# Altium project Control Board.PrjPcb
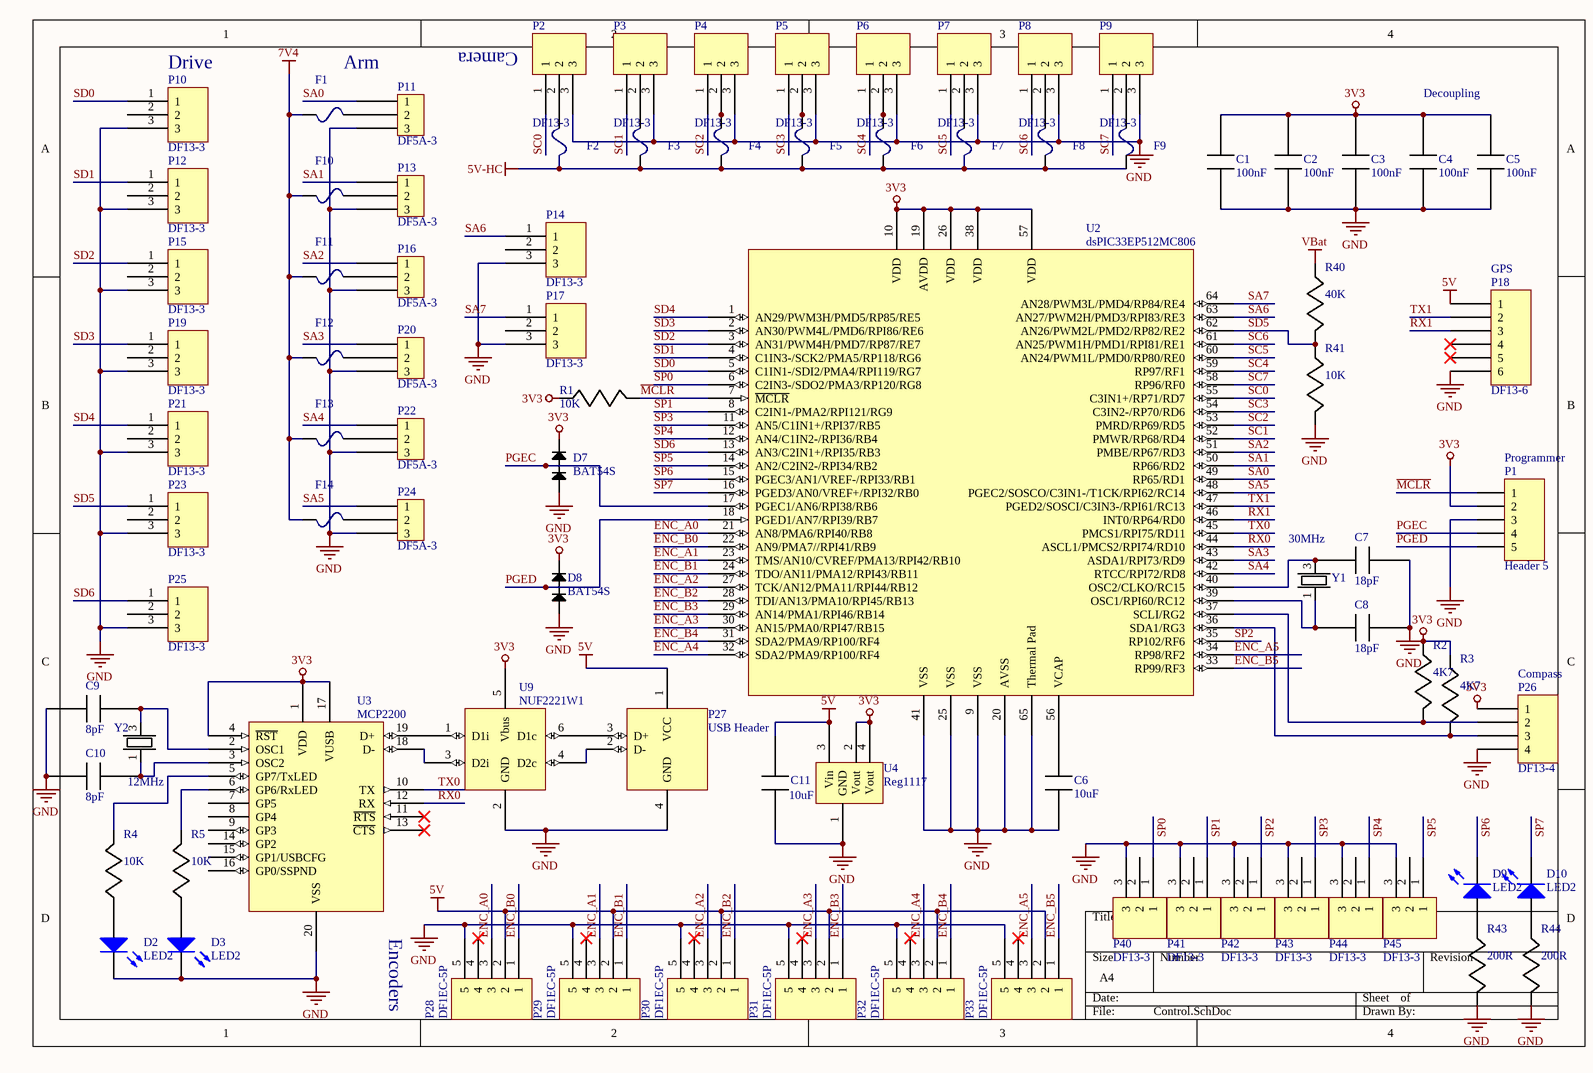
[diagram p0: Control.SchDoc]
7 sheets, 197 parts. Net scope: global (net labels, ports and power ports of the same name join across sheets).
Board file: ControlBoard.PcbDoc
Sheets:
  Control.SchDoc
  Power24V.SchDoc
  Power12V.SchDoc
  Power19V.SchDoc
  Power5V.SchDoc
  Power7V4.SchDoc
  Power.SchDoc

## Sheet Control.SchDoc
size A4

### Parts
C1  100nF  [1608[0603]]
C2  100nF  [1608[0603]]
C3  100nF  [1608[0603]]
C4  100nF  [1608[0603]]
C5  100nF  [1608[0603]]
C6  10uF  [1608[0603]]
C7  18pF  [1608[0603]]
C8  18pF  [1608[0603]]
C9  8pF  [1608[0603]]
C10  8pF  [1608[0603]]
C11  Size: 10uF  [1608[0603]]
D2  LED2  [3.2X1.6X1.1]
D3  LED2  [3.2X1.6X1.1]
D7  BAT54S  [SOT90P240X110-3N]
D8  BAT54S  [SOT90P240X110-3N]
D9  LED2  [1608[0603]]
D10  LED2  [1608[0603]]
F1  RSTA 2-BULK  [56400001009]  (value not drawn)
F2  RSTA 2-BULK  [56400001009]  (value not drawn)
F3  RSTA 2-BULK  [56400001009]  (value not drawn)
F4  RSTA 2-BULK  [56400001009]  (value not drawn)
F5  RSTA 2-BULK  [56400001009]  (value not drawn)
F6  RSTA 2-BULK  [56400001009]  (value not drawn)
F7  RSTA 2-BULK  [56400001009]  (value not drawn)
F8  RSTA 2-BULK  [56400001009]  (value not drawn)
F9  RSTA 2-BULK  [56400001009]  (value not drawn)
F10  RSTA 2-BULK  [56400001009]  (value not drawn)
F11  RSTA 2-BULK  [56400001009]  (value not drawn)
F12  RSTA 2-BULK  [56400001009]  (value not drawn)
F13  RSTA 2-BULK  [56400001009]  (value not drawn)
F14  RSTA 2-BULK  [56400001009]  (value not drawn)
P1  Header 5  [HDR1X5]
P2  DF13-3  [DF13-3]
P3  DF13-3  [DF13-3]
P4  DF13-3  [DF13-3]
P5  DF13-3  [DF13-3]
P6  DF13-3  [DF13-3]
P7  DF13-3  [DF13-3]
P8  DF13-3  [DF13-3]
P9  DF13-3  [DF13-3]
P10  DF13-3  [DF13-3]
P11  DF5A-3  [DF5A-3]
P12  DF13-3  [DF13-3]
P13  DF5A-3  [DF5A-3]
P14  DF13-3  [DF13-3]
P15  DF13-3  [DF13-3]
P16  DF5A-3  [DF5A-3]
P17  DF13-3  [DF13-3]
P18  DF13-6  [DF13-6S-1.25H]
P19  DF13-3  [DF13-3]
P20  DF5A-3  [DF5A-3]
P21  DF13-3  [DF13-3]
P22  DF5A-3  [DF5A-3]
P23  DF13-3  [DF13-3]
P24  DF5A-3  [DF5A-3]
P25  DF13-3  [DF13-3]
P26  DF13-4  [DF13-4S-1.25H]
P27  USB Header  [USB-B]
P28  DF1EC-5P  [DF1EC-4P]
P29  DF1EC-5P  [DF1EC-4P]
P30  DF1EC-5P  [DF1EC-4P]
P31  DF1EC-5P  [DF1EC-4P]
P32  DF1EC-5P  [DF1EC-4P]
P33  DF1EC-5P  [DF1EC-4P]
P40  DF13-3  [DF13-3]
P41  DF13-3  [DF13-3]
P42  DF13-3  [DF13-3]
P43  DF13-3  [DF13-3]
P44  DF13-3  [DF13-3]
P45  DF13-3  [DF13-3]
R1  Size: 10K  [1608[0603]]
R2  Size: 4K7  [1608[0603]]
R3  Size: 4K7  [1608[0603]]
R4  Size: 10K  [1608[0603]]
R5  Size: 10K  [1608[0603]]
R40  Size: 40K  [1608[0603]]
R41  Size: 10K  [1608[0603]]
R43  Size: 200R  [1608[0603]]
R44  Size: 200R  [1608[0603]]
U2  dsPIC33EP512MC806  [QFN50P900X900X100_HS-65N]
U3  MCP2200  [SOP65P780X200-20N]
U4  Reg1117  [SOT230P700X180-4N]
U9  NUF2221W1  [TSOP65P210X110-6N]
Y1  value 30MHz  [7M-30.000MBBK-T]  (hidden comment: NX5032GC)
Y2  value 12MHz  [NX5032GC]  (hidden comment: NX5032GC)

### Nets
3V3: C1.2 C2.2 C3.2 C4.2 C5.2 D7.2(D1i) D8.2(D1i) P1.2 P26.1 R1.2 R2.2 R3.2 U2.10(VDD) U2.19(AVDD) U2.26(VDD) U2.38(VDD) U2.57(VDD) U3.1(VDD) U3.4(~{RST}) U3.17(VUSB) U4.2(Vout) U4.4(Vout) U9.5(Vbus)
5V: C11.2 P18.1 P27.1(VCC) P28.2 P29.2 P30.2 P31.2 P32.2 P33.2 U4.3(Vin)
5V-HC: F2.2 F3.1 F4.1 F5.1 F6.1 F7.1 F8.1 F9.1
7V4: F1.1 F10.1 F11.1 F12.1 F13.1 F14.1
GND: C1.1 C2.1 C3.1 C4.1 C5.1 C6.1 C7.1 C8.1 C9.2 C10.2 C11.1 D2.2(K) D3.2(K) D7.1(D1i) D8.1(D1i) P1.3 P2.3 P3.3 P4.3 P5.3 P6.3 P7.3 P8.3 P9.3 P10.3 P11.3 P12.3 P13.3 P14.3 P15.3 P16.3 P17.3 P18.6 P19.3 P20.3 P21.3 P22.3 P23.3 P24.3 P25.3 P26.4 P27.4(GND) P28.5 P29.5 P30.5 P31.5 P32.5 P33.5 P40.3 P41.3 P42.3 P43.3 P44.3 P45.3 R41.1 R43.1 R44.1 U2.9(VSS) U2.20(AVSS) U2.25(VSS) U2.41(VSS) U2.65(Thermal_Pad) U3.20(VSS) U4.1(GND) U9.2(GND)
VBat: R40.2
ENC_A0: P28.3 U2.21(AN8/PMA6/RPI40/RB8)
ENC_A1: P29.3 U2.23(TMS/AN10/CVREF/PMA13/RPI42/RB10)
ENC_A2: P30.3 U2.27(TCK/AN12/PMA11/RPI44/RB12)
ENC_A3: P31.3 U2.30(AN15/PMA0/RPI47/RB15)
ENC_A4: P32.3 U2.32(SDA2/PMA9/RP100/RF4)
ENC_A5: P33.3 U2.34(RP98/RF2)
ENC_B0: P28.1 U2.22(AN9/PMA7//RPI41/RB9)
ENC_B1: P29.1 U2.24(TDO/AN11/PMA12/RPI43/RB11)
ENC_B2: P30.1 U2.28(TDI/AN13/PMA10/RPI45/RB13)
ENC_B3: P31.1 U2.29(AN14/PMA1/RPI46/RB14)
ENC_B4: P32.1 U2.31(SDA2/PMA9/RP100/RF4)
ENC_B5: P33.1 U2.33(RP99/RF3)
~{MCLR}: P1.1 R1.1 U2.7(~{MCLR})
PGEC: D7.3(D1i) P1.4 U2.17(PGEC1/AN6/RPI38/RB6)
PGED: D8.3(D1i) P1.5 U2.18(PGED1/AN7/RPI39/RB7)
RX0: U2.44(ASCL1/PMCS2/RPI74/RD10) U3.12(RX)
RX1: P18.3 U2.46(INT0/RP64/RD0)
SA0: P11.1 U2.49(RP65/RD1)
SA1: P13.1 U2.50(RP66/RD2)
SA2: P16.1 U2.51(PMBE/RP67/RD3)
SA3: P20.1 U2.43(ASDA1/RPI73/RD9)
SA4: P22.1 U2.42(RTCC/RPI72/RD8)
SA5: P24.1 U2.48(PGEC2/SOSCO/C3IN1-/T1CK/RPI62/RC14)
SA6: P14.1 U2.63(AN27/PWM2H/PMD3/RPI83/RE3)
SA7: P17.1 U2.64(AN28/PWM3L/PMD4/RP84/RE4)
SC0: P2.1 U2.55(C3IN1+/RP71/RD7)
SC1: P3.1 U2.52(PMWR/RP68/RD4)
SC2: P4.1 U2.53(PMRD/RP69/RD5)
SC3: P5.1 U2.54(C3IN2-/RP70/RD6)
SC4: P6.1 U2.59(RP97/RF1)
SC5: P7.1 U2.60(AN24/PWM1L/PMD0/RP80/RE0)
SC6: P8.1 U2.61(AN25/PWM1H/PMD1/RPI81/RE1)
SC7: P9.1 U2.58(RP96/RF0)
SD0: P10.1 U2.5(C1IN1-/SDI2/PMA4/RPI119/RG7)
SD1: P12.1 U2.4(C1IN3-/SCK2/PMA5/RP118/RG6)
SD2: P15.1 U2.3(AN31/PWM4H/PMD7/RP87/RE7)
SD3: P19.1 U2.2(AN30/PWM4L/PMD6/RPI86/RE6)
SD4: P21.1 U2.1(AN29/PWM3H/PMD5/RP85/RE5)
SD5: P23.1 R40.1 R41.2 U2.62(AN26/PWM2L/PMD2/RP82/RE2)
SD6: P25.1 U2.13(AN3/C2IN1+/RPI35/RB3)
SP0: P40.1 U2.6(C2IN3-/SDO2/PMA3/RP120/RG8)
SP1: P41.1 U2.8(C2IN1-/PMA2/RPI121/RG9)
SP2: P42.1 U2.35(RP102/RF6)
SP3: P43.1 U2.11(AN5/C1IN1+/RPI37/RB5)
SP4: P44.1 U2.12(AN4/C1IN2-/RPI36/RB4)
SP5: P45.1 U2.14(AN2/C2IN2-/RPI34/RB2)
SP6: D9.2(K) U2.15(PGEC3/AN1/VREF-/RPI33/RB1)
SP7: D10.2(K) U2.16(PGED3/AN0/VREF+/RPI32/RB0)
TX0: U2.45(PMCS1/RPI75/RD11) U3.10(TX)
TX1: P18.2 U2.47(PGED2/SOSCI/C3IN3-/RPI61/RC13)
NetC6_2: C6.2 U2.56(VCAP)
NetC7_2: C7.2 U2.40(OSC2/CLKO/RC15) Y1.3
NetC8_2: C8.2 U2.39(OSC1/RPI60/RC12) Y1.1
NetC9_1: C9.1 U3.2(OSC1) Y2.3
NetC10_1: C10.1 U3.3(OSC2) Y2.1
NetD2_1: D2.1(A) R4.2
NetD3_1: D3.1(A) R5.2
NetD9_1: D9.1(A) R43.2
NetD10_1: D10.1(A) R44.2
NetF1_2: F1.2 P11.2
NetF2_1: F2.1 P2.2
NetF3_2: F3.2 P3.2
NetF4_2: F4.2 P4.2
NetF5_2: F5.2 P5.2
NetF6_2: F6.2 P6.2
NetF7_2: F7.2 P7.2
NetF8_2: F8.2 P8.2
NetF9_2: F9.2 P9.2
NetF10_2: F10.2 P13.2
NetF11_2: F11.2 P16.2
NetF12_2: F12.2 P20.2
NetF13_2: F13.2 P22.2
NetF14_2: F14.2 P24.2
NetP26_2: P26.2 R2.1 U2.37(SCLI/RG2)
NetP26_3: P26.3 R3.1 U2.36(SDA1/RG3)
NetP27_2: P27.2(D-) U9.4(D2c)
NetP27_3: P27.3(D+) U9.6(D1c)
NetR4_1: R4.1 U3.5(GP7/TxLED)
NetR5_1: R5.1 U3.6(GP6/RxLED)
NetU3_18: U3.18(D-) U9.3(D2i)
NetU3_19: U3.19(D+) U9.1(D1i)

Not connected (* = marked no-connect by the designer): P10 2; P12 2; P14 2; P15 2; P17 2; P18 4* 5*; P19 2; P21 2; P23 2; P25 2; P28 4*; P29 4*; P30 4*; P31 4*; P32 4*; P33 4*; P40 2; P41 2; P42 2; P43 2; P44 2; P45 2; U3 7(GP5) 8(GP4) 9(GP3) 11(~{RTS})* 13(~{CTS})* 14(GP2) 15(GP1/USBCFG) 16(GP0/SSPND)

### Notes on the sheet
- (near P2) Camera
- (near P10) Drive
- Arm
- Decoupling
- (near P18) GPS
- (near P1) Programmer
- (near P26) Compass
- (near U3) Encoders

### Library data of the parts
C1-C11 = Capacitor
D2 D3 D9 D10 = LED2: Typical RED, GREEN, YELLOW, AMBER GaAs LED; Published: 8-Jun-2000; LatestRevisionDate: 17-Jul-2002; LatestRevisionNote: Re-released for DXP Platform.; PackageVersion: Feb-2002; PackageReference: 3.2X1.6X1.1; Publisher: Altium Limited; PackageDescription: SM LED; 2 Flat Leads
F1-F14 = RSTA 2-BULK: FUSE 2A 250/277V RADIAL
P1 = Header 5: Header, 5-Pin; LatestRevisionDate: 17-Jul-2002; LatestRevisionNote: Re-released for DXP Platform.; Publisher: Altium Limited
R1-R5 R40 R41 R43 R44 = Resistor

## Sheet Power24V.SchDoc
size 283 x 191 mm; SheetNumber: 1; SheetTotal: 1
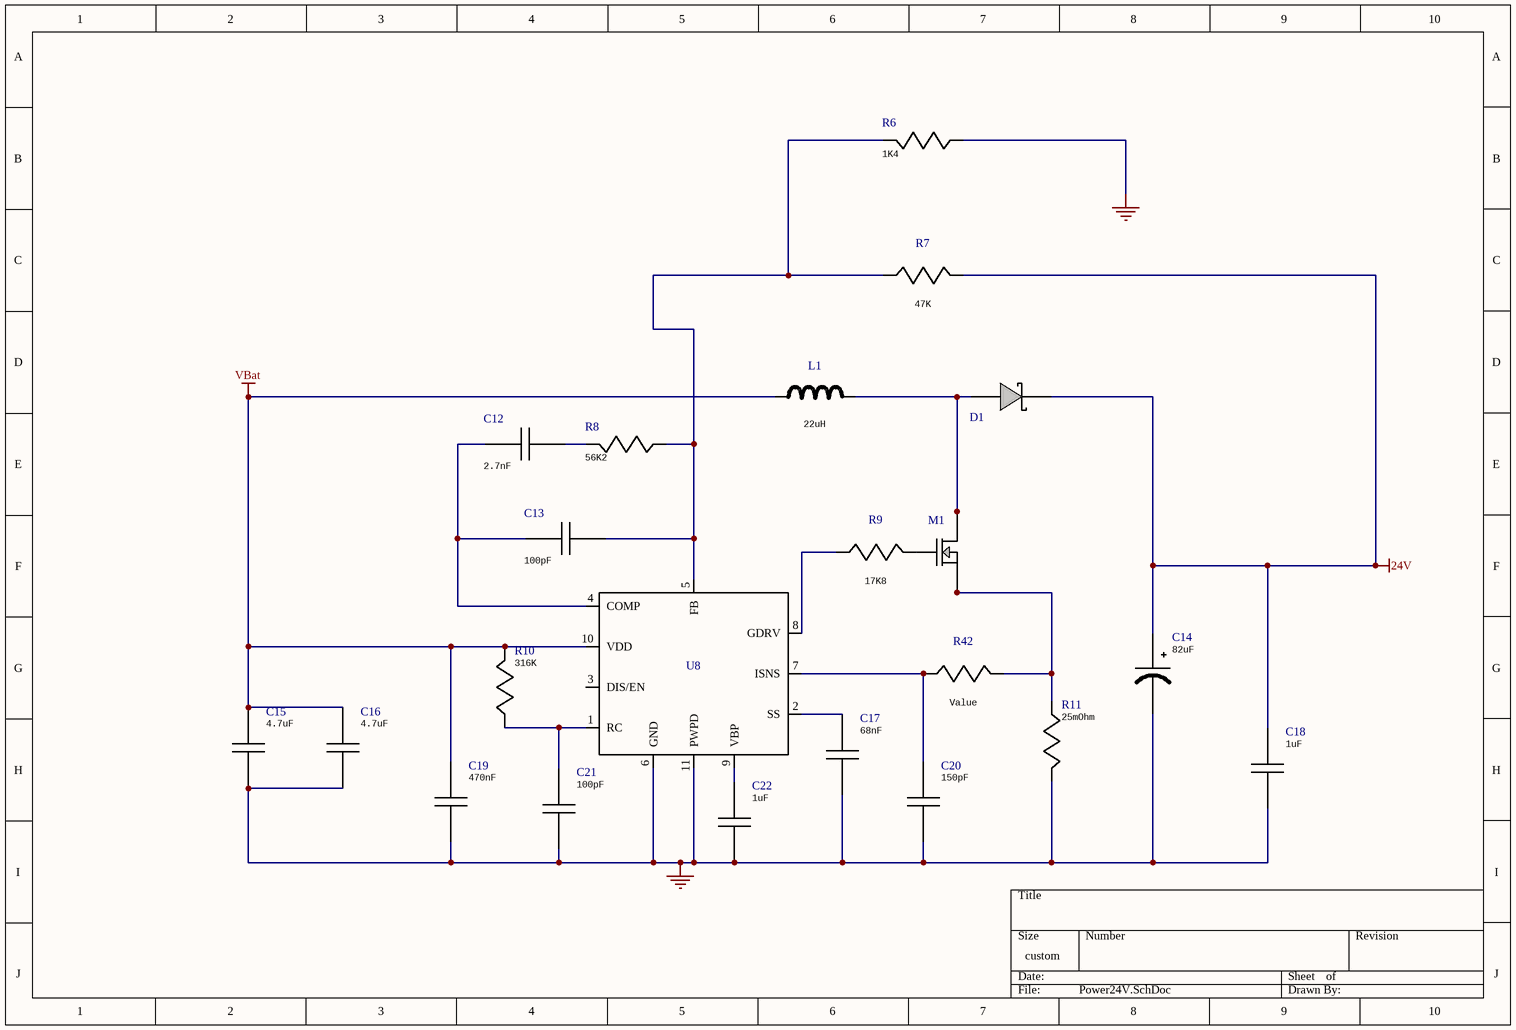
[diagram p1: Power24V.SchDoc]

### Parts
C12  value 2.7nF  [1608]  (hidden comment: CC0805KRX7R9BB27)
C13  value 100pF  [1608]  (hidden comment: CC0805JRNPO9BN10)
C14  value 82uF  [CAPSMT_62_E12]  (hidden comment: 35SVPF82M)
C15  value 4.7uF  [0805]  (hidden comment: GRM21BR61E475MA1)
C16  value 4.7uF  [0805]  (hidden comment: GRM21BR61E475MA1)
C17  value 68nF  [1608]  (hidden comment: GRM155R61A683KA0)
C18  value 1uF  [0805]  (hidden comment: GMK212B7105KG-T)
C19  value 470nF  [0805]  (hidden comment: EMK212B7474KD-T)
C20  value 150pF  [0805]  (hidden comment: CC0805JRNPO9BN15)
C21  value 100pF  [1608]  (hidden comment: CC0805JRNPO9BN10)
C22  value 1uF  [1608]  (hidden comment: C1608X5R1C105K)
D1  B240A-13-F  [SMA]  (value not drawn)
L1  value 22uH  [SRR1210]  (hidden comment: SRR1210-220M)
M1  CSD17551Q5A  [TRANS_NexFET_Q5A]  (value not drawn)
R6  value 1K4  [1608]  (hidden comment: CRCW04021K40FKED)
R7  value 47K  [1608]  (hidden comment: RR1220P-473-D)
R8  value 56K2  [1608]  (hidden comment: CRCW040256K2FKED)
R9  value 17K8  [1608]  (hidden comment: CRCW040217R8FKED)
R10  value 316K  [1608]  (hidden comment: CRCW0402316KFKED)
R11  value 25mOhm  [1206]  (hidden comment: CSR1206FK25L0)
R42  CRCW04021K00FKED  [1608]  (value not drawn)
U8  TPS40210DGQR  [S-PDSO-G10]  (value not drawn)

### Nets
24V: C14.1(+) C18.1 D1.1(K) R7.1
GND: C14.2(-) C15.2 C16.2 C17.2 C18.2 C19.2 C20.2 C21.2 C22.2 R6.2 R11.1 U8.6(GND) U8.11(PWPD)
VBat: C15.1 C16.1 C19.1 L1.1 R10.1 U8.10(VDD)
NetC12_1: C12.1 C13.1 U8.4(COMP)
NetC12_2: C12.2 R8.1
NetC13_2: C13.2 R6.1 R7.2 R8.2 U8.5(FB)
NetC17_1: C17.1 U8.2(SS)
NetC20_1: C20.1 R42.2 U8.7(ISNS)
NetC21_1: C21.1 R10.2 U8.1(RC)
NetC22_1: C22.1 U8.9(VBP)
NetD1_2: D1.2(A) L1.2 M1.5(Drain) M1.6(Drain) M1.7(Drain) M1.8(Drain) M1.9(Drain)
NetM1_1: M1.1(Source) M1.2(Source) M1.3(Source) R11.2 R42.1
NetM1_4: M1.4(Gate) R9.1
NetR9_2: R9.2 U8.8(GDRV)

Not connected (* = marked no-connect by the designer): U8 3(DIS/EN)

### Library data of the parts
C12 = CC0805KRX7R9BB27: Imported; Manufacturer_Part_Number: CC0805KRX7R9BB272; Vendor: Yageo America; RefName: Ccomp; Manufacturer_Name: Yageo America; RefDes: RefDes; TYPE: TYPE
C13 = CC0805JRNPO9BN10: Imported; Manufacturer_Part_Number: CC0805JRNPO9BN101; Vendor: Yageo America; RefName: Ccomp2; Manufacturer_Name: Yageo America; RefDes: RefDes; TYPE: TYPE
C14 = 35SVPF82M: Imported; Vendor: Panasonic; RN: Cout; Manufacturer_Part_Number: 35SVPF82M; Manufacturer_Name: Panasonic; RefDes: RefDes; TYPE: TYPE
C15 C16 = GRM21BR61E475MA1: Imported; Manufacturer_Part_Number: GRM21BR61E475MA12L; Vendor: MuRata; RefName: Cin; Manufacturer_Name: MuRata; RefDes: RefDes; TYPE: TYPE
C17 = GRM155R61A683KA0: Imported; Manufacturer_Part_Number: GRM155R61A683KA01D; Vendor: MuRata; RN: Css; Manufacturer_Name: MuRata; RefDes: RefDes; TYPE: TYPE
C18 = GMK212B7105KG-T: Imported; Vendor: Taiyo Yuden; RN: Coutx; Manufacturer_Part_Number: GMK212B7105KG-T; Manufacturer_Name: Taiyo Yuden; RefDes: RefDes; TYPE: TYPE
C19 = EMK212B7474KD-T: Imported; Vendor: Taiyo Yuden; RefName: Cbyp; Manufacturer_Part_Number: EMK212B7474KD-T; Manufacturer_Name: Taiyo Yuden; RefDes: RefDes; TYPE: TYPE
C20 = CC0805JRNPO9BN15: Imported; Manufacturer_Part_Number: CC0805JRNPO9BN151; Vendor: Yageo America; RN: Ciflt; Manufacturer_Name: Yageo America; RefDes: RefDes; TYPE: TYPE
C21 = CC0805JRNPO9BN10: Imported; Manufacturer_Part_Number: CC0805JRNPO9BN101; Vendor: Yageo America; RefName: Crc; Manufacturer_Name: Yageo America; RefDes: RefDes; TYPE: TYPE
C22 = C1608X5R1C105K: Imported; Vendor: TDK; RefName: Cbp; Manufacturer_Part_Number: C1608X5R1C105K; Manufacturer_Name: TDK; RefDes: RefDes; TYPE: TYPE
D1 = B240A-13-F: Imported; Vendor: Diodes Inc.; Value: Value; Manufacturer_Part_Number: B240A-13-F; Manufacturer_Name: Diodes Inc.; RefDes: RefDes; Type: Type
L1 = SRR1210-220M: Imported; Vendor: Bourns; Manufacturer_Part_Number: SRR1210-220M; Manufacturer_Name: Bourns; RefDes: RefDes; TYPE: TYPE
M1 = CSD17551Q5A: Imported; Vendor: Texas Instruments; Value: Value; Manufacturer_Part_Number: CSD17551Q5A; Manufacturer_Name: Texas Instruments; RefDes: RefDes; TYPE: TYPE
R6 = CRCW04021K40FKED: Imported; Vendor: Vishay-Dale; RN: Rfb1; Manufacturer_Part_Number: CRCW04021K40FKED; Manufacturer_Name: Vishay-Dale; RefDes: RefDes; TYPE: TYPE
R7 = RR1220P-473-D: Imported; Vendor: Susumu Co Ltd; RN: Rfb2; Manufacturer_Part_Number: RR1220P-473-D; Manufacturer_Name: Susumu Co Ltd; RefDes: RefDes; TYPE: TYPE
R8 = CRCW040256K2FKED: Imported; Vendor: Vishay-Dale; RefName: Rcomp; Manufacturer_Part_Number: CRCW040256K2FKED; Manufacturer_Name: Vishay-Dale; RefDes: RefDes; TYPE: TYPE
R9 = CRCW040217R8FKED: Imported; Vendor: Vishay-Dale; RN: Rg; Manufacturer_Part_Number: CRCW040217R8FKED; Manufacturer_Name: Vishay-Dale; RefDes: RefDes; TYPE: TYPE
R10 = CRCW0402316KFKED: Imported; Vendor: Vishay-Dale; RefName: Rrc; Manufacturer_Part_Number: CRCW0402316KFKED; Manufacturer_Name: Vishay-Dale; RefDes: RefDes; TYPE: TYPE
R11 = CSR1206FK25L0: Imported; Vendor: Stackpole Electronics Inc; rn: Rsense; Manufacturer_Part_Number: CSR1206FK25L0; Manufacturer_Name: Stackpole Electronics Inc; RefDes: RefDes; TYPE: TYPE
R42 = CRCW04021K00FKED: Riflt; Vendor: Vishay-Dale; Value: Value; Manufacturer_Part_Number: CRCW04021K00FKED; Manufacturer_Name: Vishay-Dale; RefDes: RefDes; TYPE: TYPE
U8 = TPS40210DGQR: Imported; Vendor: Texas Instruments; Value: Value; Manufacturer_Part_Number: TPS40210DGQR; Manufacturer_Name: Texas Instruments; RefDes: RefDes; TYPE: TYPE

## Sheet Power12V.SchDoc
size 359 x 172 mm; SheetNumber: 1; SheetTotal: 1
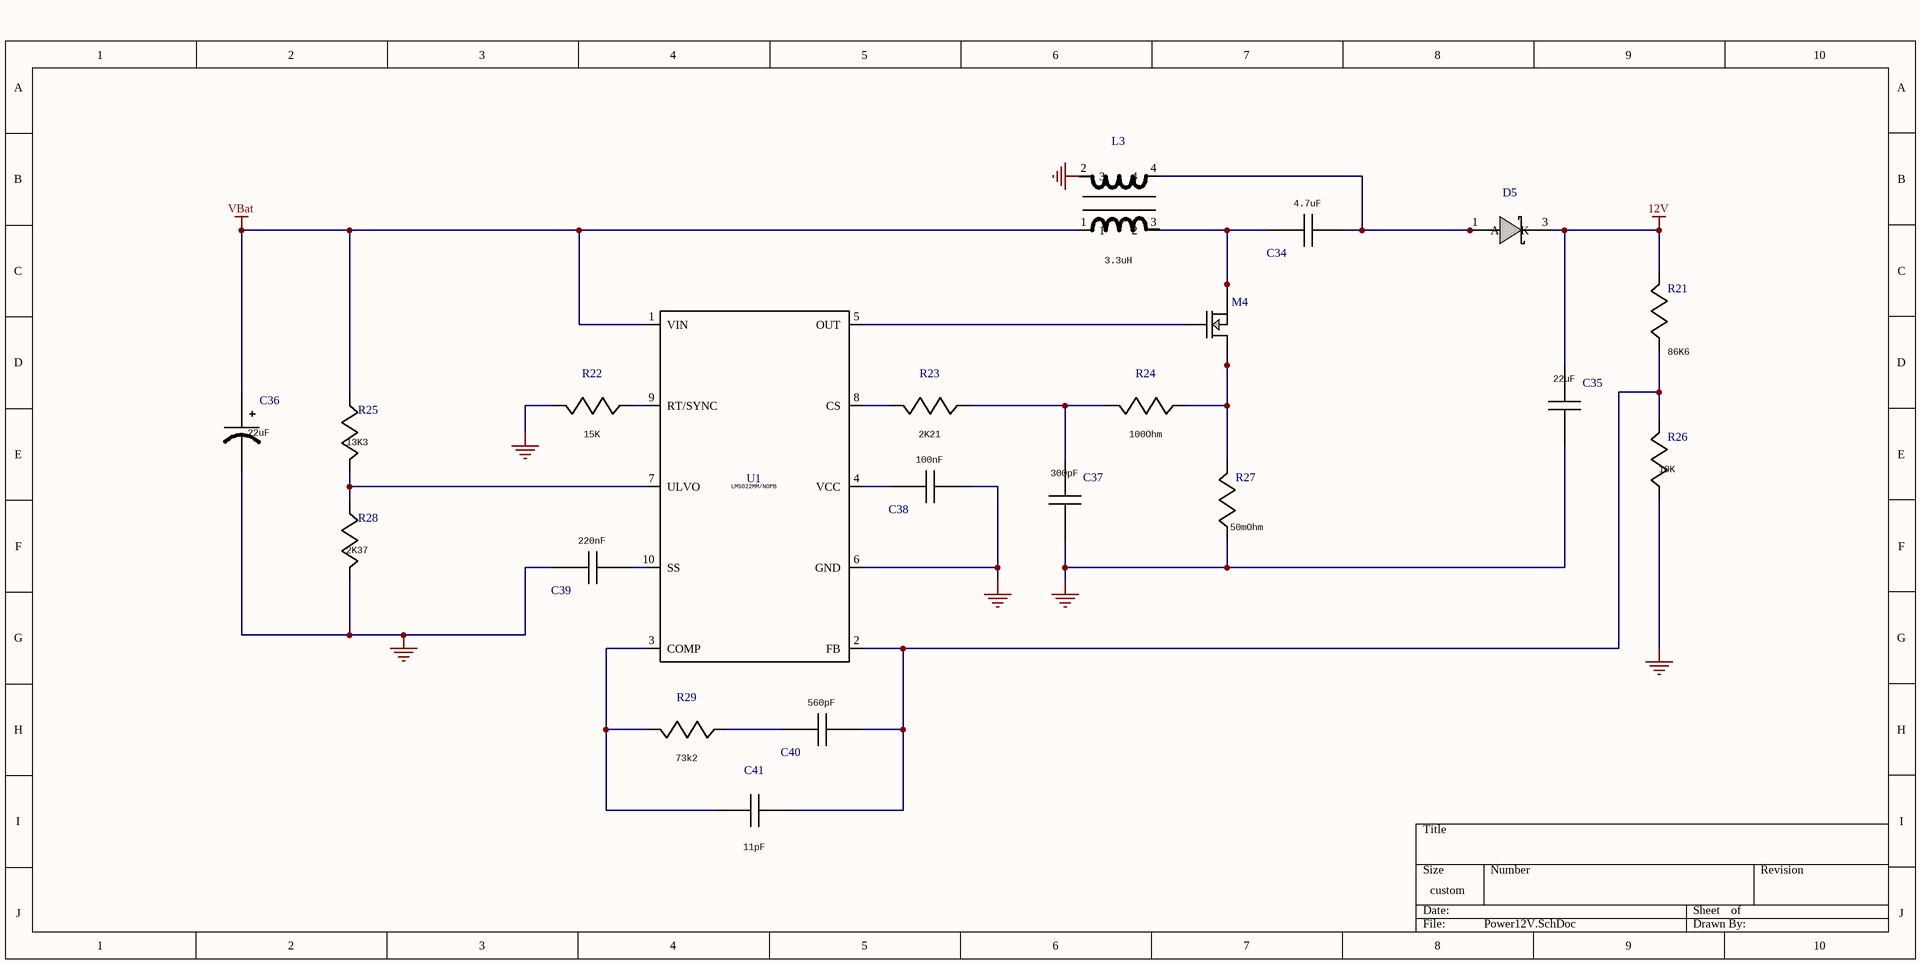
[diagram p2: Power12V.SchDoc]

### Parts
C34  value 4.7uF  [0805]  (hidden comment: GRM21BR61E475MA1)
C35  value 22uF  [1210]  (hidden comment: GRM32ER61C226KE2)
C36  value 22uF  [3528-21]  (hidden comment: TPSB226K020R0400)
C37  value 300pF  [1608]  (hidden comment: GRM1555C1E301JA0)
C38  value 100nF  [1608]  (hidden comment: GRM155R61C104KA8)
C39  value 220nF  [1608]  (hidden comment: GRM155R71C224KA1)
C40  value 560pF  [1608]  (hidden comment: CC0805KRX7R9BB56)
C41  value 11pF  [1608]  (hidden comment: C0603C0G1E110G)
D5  PDS760-13  [PowerDI5]  (value not drawn)
L3  value 3.3uH  [DRQ127]  (hidden comment: DRQ127-3R3-R)
M4  CSD16340Q3  [TRANS_NexFET_Q3]  (value not drawn)
R21  value 86K6  [1608]  (hidden comment: CRCW040286K6FKED)
R22  value 15K  [1608]  (hidden comment: CRCW040215K0FKED)
R23  value 2K21  [1608]  (hidden comment: CRCW04022K21FKED)
R24  value 100Ohm  [1608]  (hidden comment: CRCW0402100RFKED)
R25  value 13K3  [1608]  (hidden comment: CRCW040213K3FKED)
R26  value 10K  [1608]  (hidden comment: CRCW040210K0FKED)
R27  value 50mOhm  [2010]  (hidden comment: CSRN2010FK50L0)
R28  value 2K37  [1608]  (hidden comment: CRCW04022K37FKED)
R29  value 73k2  [1608]  (hidden comment: CRCW040273K2FKED)
U1  LM5022MM/NOPB  [MUB10A]

### Nets
12V: C35.1 D5.3(K) R21.1
GND: C35.2 C36.2(-) C37.2 C38.2 C39.2 L3.2(3) R22.1 R26.2 R27.2 R28.1 U1.6(GND)
VBat: C36.1(+) L3.1 R25.2 U1.1(VIN)
NetC34_1: C34.1 D5.1(A) D5.2(A) L3.4
NetC34_2: C34.2 L3.3(2) M4.1(Source) M4.2(Source) M4.3(Source)
NetC37_1: C37.1 R23.2 R24.1
NetC38_1: C38.1 U1.4(VCC)
NetC39_1: C39.1 U1.10(SS)
NetC40_1: C40.1 C41.1 R21.2 R26.1 U1.2(FB)
NetC40_2: C40.2 R29.2
NetC41_2: C41.2 R29.1 U1.3(COMP)
NetM4_4: M4.4(Gate) U1.5(OUT)
NetM4_5: M4.5(Drain) M4.6(Drain) M4.7(Drain) M4.8(Drain) M4.9(Drain) R24.2 R27.1
NetR22_2: R22.2 U1.9(RT/SYNC)
NetR23_1: R23.1 U1.8(CS)
NetR25_1: R25.1 R28.2 U1.7(ULVO)

### Library data of the parts
C34 = GRM21BR61E475MA1: Imported; Manufacturer_Part_Number: GRM21BR61E475MA12L; Vendor: MuRata; rn: Csep; Manufacturer_Name: MuRata; RefDes: RefDes; TYPE: TYPE
C35 = GRM32ER61C226KE2: Imported; Manufacturer_Part_Number: GRM32ER61C226KE20L; Vendor: MuRata; rn: Cout; Manufacturer_Name: MuRata; RefDes: RefDes; TYPE: TYPE
C36 = TPSB226K020R0400: Imported; Vendor: AVX; rn: Cin; Manufacturer_Part_Number: TPSB226K020R0400; Manufacturer_Name: AVX; RefDes: RefDes; TYPE: TYPE
C37 = GRM1555C1E301JA0: Imported; Manufacturer_Part_Number: GRM1555C1E301JA01D; Vendor: MuRata; rn: Cramp; Manufacturer_Name: MuRata; RefDes: RefDes; TYPE: TYPE
C38 = GRM155R61C104KA8: Imported; Manufacturer_Part_Number: GRM155R61C104KA88D; Vendor: MuRata; rn: Ccc; Manufacturer_Name: MuRata; RefDes: RefDes; TYPE: TYPE
C39 = GRM155R71C224KA1: Imported; Manufacturer_Part_Number: GRM155R71C224KA12D; Vendor: MuRata; rn: Css; Manufacturer_Name: MuRata; RefDes: RefDes; TYPE: TYPE
C40 = CC0805KRX7R9BB56: Imported; Manufacturer_Part_Number: CC0805KRX7R9BB561; Vendor: Yageo America; rn: Ccomp; Manufacturer_Name: Yageo America; RefDes: RefDes; TYPE: TYPE
C41 = C0603C0G1E110G: Imported; Vendor: TDK; rn: Ccomp2; Manufacturer_Part_Number: C0603C0G1E110G; Manufacturer_Name: TDK; RefDes: RefDes; TYPE: TYPE
D5 = PDS760-13: Imported; Vendor: Diodes Inc.; Value: Value; Manufacturer_Part_Number: PDS760-13; Manufacturer_Name: Diodes Inc.; RefDes: RefDes; TYPE: TYPE
L3 = DRQ127-3R3-R: Imported; Type: SMT; Vendor: Coiltronics; Manufacturer_Part_Number: DRQ127-3R3-R; Manufacturer_Name: Coiltronics; RefDes: RefDes
M4 = CSD16340Q3: Imported; Vendor: Texas Instruments; Value: Value; Manufacturer_Part_Number: CSD16340Q3; Manufacturer_Name: Texas Instruments; RefDes: RefDes; TYPE: TYPE
R21 = CRCW040286K6FKED: Imported; Vendor: Vishay-Dale; rn: Rfb2; Manufacturer_Part_Number: CRCW040286K6FKED; Manufacturer_Name: Vishay-Dale; RefDes: RefDes; TYPE: TYPE
R22 = CRCW040215K0FKED: Imported; Vendor: Vishay-Dale; rn: Rfadj; Manufacturer_Part_Number: CRCW040215K0FKED; Manufacturer_Name: Vishay-Dale; RefDes: RefDes; TYPE: TYPE
R23 = CRCW04022K21FKED: Imported; Vendor: Vishay-Dale; rn: Rramp2; Manufacturer_Part_Number: CRCW04022K21FKED; Manufacturer_Name: Vishay-Dale; RefDes: RefDes; TYPE: TYPE
R24 = CRCW0402100RFKED: Imported; Vendor: Vishay-Dale; rn: Rramp; Manufacturer_Part_Number: CRCW0402100RFKED; Manufacturer_Name: Vishay-Dale; RefDes: RefDes; TYPE: TYPE
R25 = CRCW040213K3FKED: Imported; Vendor: Vishay-Dale; rn: Ruvpt; Manufacturer_Part_Number: CRCW040213K3FKED; Manufacturer_Name: Vishay-Dale; RefDes: RefDes; TYPE: TYPE
R26 = CRCW040210K0FKED: Imported; Vendor: Vishay-Dale; rn: Rfb1; Manufacturer_Part_Number: CRCW040210K0FKED; Manufacturer_Name: Vishay-Dale; RefDes: RefDes; TYPE: TYPE
R27 = CSRN2010FK50L0: Imported; Vendor: Stackpole Electronics Inc; rn: Rsense; Manufacturer_Part_Number: CSRN2010FK50L0; Manufacturer_Name: Stackpole Electronics Inc; RefDes: RefDes; TYPE: TYPE
R28 = CRCW04022K37FKED: Imported; Vendor: Vishay-Dale; rn: Ruvpb; Manufacturer_Part_Number: CRCW04022K37FKED; Manufacturer_Name: Vishay-Dale; RefDes: RefDes; TYPE: TYPE
R29 = CRCW040273K2FKED: Imported; Vendor: Vishay-Dale; rn: Rcomp; Manufacturer_Part_Number: CRCW040273K2FKED; Manufacturer_Name: Vishay-Dale; RefDes: RefDes; TYPE: TYPE
U1 = LM5022MM/NOPB: Imported; Vendor: Texas Instruments; Value: Value; Manufacturer_Part_Number: LM5022MM/NOPB; Manufacturer_Name: Texas Instruments; RefDes: RefDes; TYPE: TYPE

## Sheet Power19V.SchDoc
size 375 x 157 mm; SheetNumber: 1; SheetTotal: 1
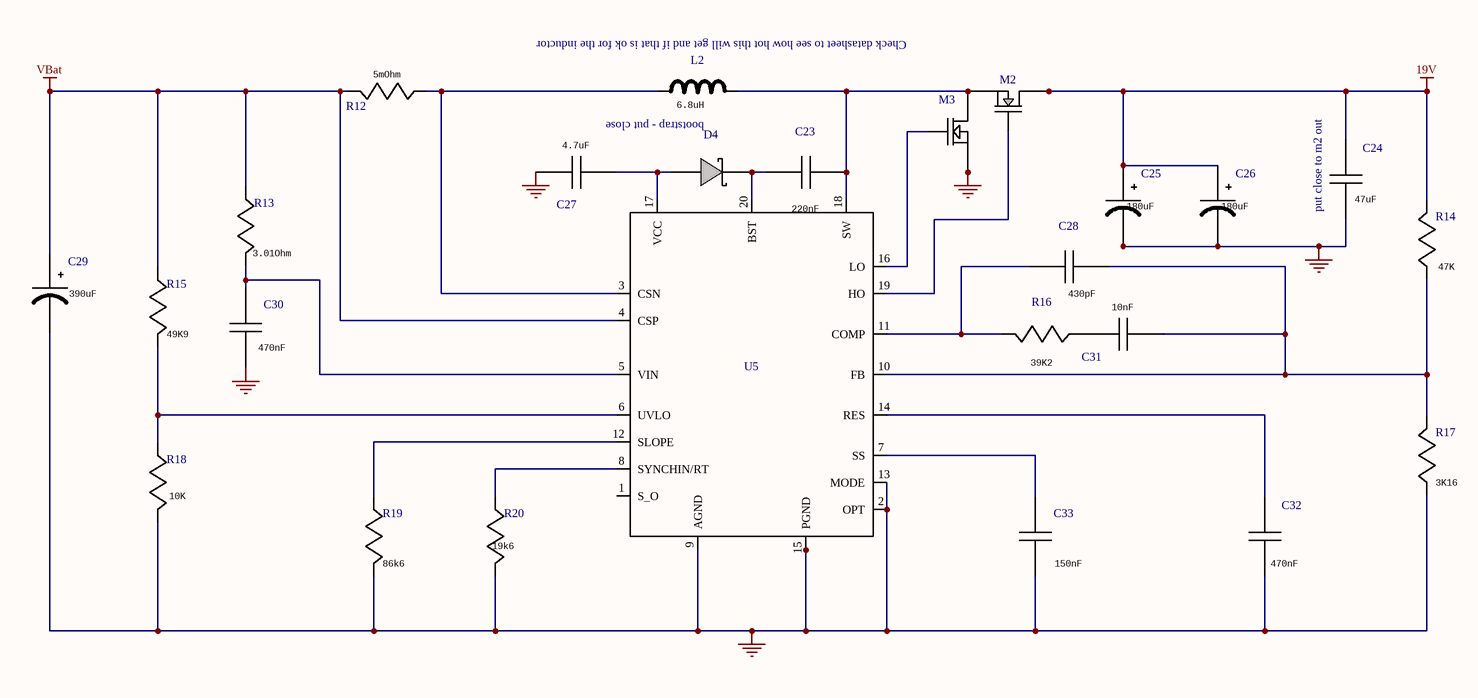
[diagram p3: Power19V.SchDoc]

### Parts
C23  value 220nF  [1608]  (hidden comment: C0805C224K5RACTU)
C24  value 47uF  [1206]  (hidden comment: C3216JB1E476M)
C25  value 180uF  [CAPSMT_62_E12]  (hidden comment: 25SVPF180M)
C26  value 180uF  [CAPSMT_62_E12]  (hidden comment: 25SVPF180M)
C27  value 4.7uF  [1608]  (hidden comment: GRM21BC81E475KA1)
C28  value 430pF  [1608]  (hidden comment: CL21C431JBANNNC)
C29  value 390uF  [CAPSMT_62_E12]  (hidden comment: 20SVPF390M)
C30  value 470nF  [1608]  (hidden comment: GRM188R71C474KA8)
C31  value 10nF  [1608]  (hidden comment: GRM216R71H103KA0)
C32  value 470nF  [1608]  (hidden comment: TMK212BJ474KD-T)
C33  value 150nF  [1608]  (hidden comment: GRM155R61A154KE1)
D4  MBR130T1G  [SOD-123]  (value not drawn)
L2  value 6.8uH  [XAL1010]  (hidden comment: XAL1010-682MEB)
M2  CSD16340Q3  [TRANS_NexFET_Q3]  (value not drawn)
M3  BSZ035N03MS G  [PG-TSDSON-8]  (value not drawn)
R12  value 5mOhm  [1608]  (hidden comment: PRL1632-R005-F-T)
R13  value 3.01Ohm  [1608]  (hidden comment: CRCW08053R01FKEA)
R14  value 47K  [1608]  (hidden comment: RR1220P-473-D)
R15  value 49K9  [1608]  (hidden comment: CRCW040249K9FKED)
R16  value 39K2  [1608]  (hidden comment: CRCW040239K2FKED)
R17  value 3K16  [1608]  (hidden comment: CRCW04023K16FKED)
R18  value 10K  [1608]  (hidden comment: CRCW040210K0FKED)
R19  value 86k6  [1608]  (hidden comment: CRCW040286K6FKED)
R20  value 19k6  [1608]  (hidden comment: CRCW040219K6FKED)
U5  LM5122MH/NOPB  [MXA20A]  (value not drawn)

### Nets
19V: C24.1 C25.1(+) C26.1(+) M2.5(Drain) M2.6(Drain) M2.7(Drain) M2.8(Drain) M2.9(Drain) R14.1
GND: C24.2 C25.2(-) C26.2(-) C27.1 C29.2(-) C30.2 C32.2 C33.2 M3.1(Source) M3.2(Source) M3.3(Source) R17.2 R18.1 R19.1 R20.1 U5.2(OPT) U5.9(AGND) U5.13(MODE) U5.15(PGND) U5.21(PGND)
VBat: C29.1(+) R12.1 R13.2 R15.2 U5.4(CSP)
NetC23_1: C23.1 D4.1(K) U5.20(BST)
NetC23_2: C23.2 L2.2 M2.1(Source) M2.2(Source) M2.3(Source) M3.5(Drain) M3.6(Drain) M3.7(Drain) M3.8(Drain) M3.9(Drain) U5.18(SW)
NetC27_2: C27.2 D4.2(A) U5.17(VCC)
NetC28_1: C28.1 C31.1 R14.2 R17.1 U5.10(FB)
NetC28_2: C28.2 R16.1 U5.11(COMP)
NetC30_1: C30.1 R13.1 U5.5(VIN)
NetC31_2: C31.2 R16.2
NetC32_1: C32.1 U5.14(RES)
NetC33_1: C33.1 U5.7(SS)
NetL2_1: L2.1 R12.2 U5.3(CSN)
NetM2_4: M2.4(Gate) U5.19(HO)
NetM3_4: M3.4(Gate) U5.16(LO)
NetR15_1: R15.1 R18.2 U5.6(UVLO)
NetR19_2: R19.2 U5.12(SLOPE)
NetR20_2: R20.2 U5.8(SYNCHIN/RT)

Not connected (* = marked no-connect by the designer): U5 1(S_O)

### Notes on the sheet
- Check datasheet to see how hot this will get and if that is ok for the inductor
- bootstrap - put close
- (near C24) put close to m2 out

### Library data of the parts
C23 = C0805C224K5RACTU: Imported; Vendor: Kemet; rn: Cbst; Manufacturer_Part_Number: C0805C224K5RACTU; Manufacturer_Name: Kemet; RefDes: RefDes; TYPE: TYPE
C24 = C3216JB1E476M: Imported; Vendor: TDK; rn: Coutx; Manufacturer_Part_Number: C3216JB1E476M; Manufacturer_Name: TDK; RefDes: RefDes; TYPE: TYPE
C25 C26 = 25SVPF180M: Imported; Vendor: Panasonic; rn: Cout; Manufacturer_Part_Number: 25SVPF180M; Manufacturer_Name: Panasonic; RefDes: RefDes; TYPE: TYPE
C27 = GRM21BC81E475KA1: Imported; Manufacturer_Part_Number: GRM21BC81E475KA12L; Vendor: MuRata; rn: Cvcc; Manufacturer_Name: MuRata; RefDes: RefDes; TYPE: TYPE
C28 = CL21C431JBANNNC: Imported; Vendor: Samsung Electro-Mechanics; rn: Ccomp2; Manufacturer_Part_Number: CL21C431JBANNNC; Manufacturer_Name: Samsung Electro-Mechanics; RefDes: RefDes; TYPE: TYPE
C29 = 20SVPF390M: Imported; Vendor: Panasonic; RN: Cin; Manufacturer_Part_Number: 20SVPF390M; Manufacturer_Name: Panasonic; RefDes: RefDes; TYPE: TYPE
C30 = GRM188R71C474KA8: Imported; Manufacturer_Part_Number: GRM188R71C474KA88D; Vendor: MuRata; rn: Cvin; Manufacturer_Name: MuRata; RefDes: RefDes; TYPE: TYPE
C31 = GRM216R71H103KA0: Imported; Manufacturer_Part_Number: GRM216R71H103KA01D; Vendor: MuRata; rn: Ccomp; Manufacturer_Name: MuRata; RefDes: RefDes; TYPE: TYPE
C32 = TMK212BJ474KD-T: Imported; Vendor: Taiyo Yuden; rn: Cres; Manufacturer_Part_Number: TMK212BJ474KD-T; Manufacturer_Name: Taiyo Yuden; RefDes: RefDes; TYPE: TYPE
C33 = GRM155R61A154KE1: Imported; Manufacturer_Part_Number: GRM155R61A154KE19D; Vendor: MuRata; rn: Css; Manufacturer_Name: MuRata; RefDes: RefDes; TYPE: TYPE
D4 = MBR130T1G: Imported; Vendor: ON Semiconductor; rn: Dbst; Value: Value; Manufacturer_Part_Number: MBR130T1G; Manufacturer_Name: ON Semiconductor; RefDes: RefDes; Type: Type
L2 = XAL1010-682MEB: Imported; Vendor: Coilcraft; Manufacturer_Part_Number: XAL1010-682MEB; Manufacturer_Name: Coilcraft; RefDes: RefDes; TYPE: TYPE
M2 = CSD16340Q3: Imported; Vendor: Texas Instruments; Value: Value; Manufacturer_Part_Number: CSD16340Q3; Manufacturer_Name: Texas Instruments; RefDes: RefDes; TYPE: TYPE
M3 = BSZ035N03MS G: Imported; Vendor: Infineon Technologies; Value: Value; Manufacturer_Part_Number: BSZ035N03MS G; Manufacturer_Name: Infineon Technologies; RefDes: RefDes; TYPE: TYPE
R12 = PRL1632-R005-F-T: Imported; Manufacturer_Part_Number: PRL1632-R005-F-T1; Vendor: Susumu Co Ltd; rn: Rs; Manufacturer_Name: Susumu Co Ltd; RefDes: RefDes; TYPE: TYPE
R13 = CRCW08053R01FKEA: Imported; Vendor: Vishay-Dale; rn: Rvin; Manufacturer_Part_Number: CRCW08053R01FKEA; Manufacturer_Name: Vishay-Dale; RefDes: RefDes; TYPE: TYPE
R14 = RR1220P-473-D: Imported; Vendor: Susumu Co Ltd; rn: Rfbt; Manufacturer_Part_Number: RR1220P-473-D; Manufacturer_Name: Susumu Co Ltd; RefDes: RefDes; TYPE: TYPE
R15 = CRCW040249K9FKED: Imported; Vendor: Vishay-Dale; rn: Ruvt; Manufacturer_Part_Number: CRCW040249K9FKED; Manufacturer_Name: Vishay-Dale; RefDes: RefDes; TYPE: TYPE
R16 = CRCW040239K2FKED: Imported; Vendor: Vishay-Dale; rn: Rcomp; Manufacturer_Part_Number: CRCW040239K2FKED; Manufacturer_Name: Vishay-Dale; RefDes: RefDes; TYPE: TYPE
R17 = CRCW04023K16FKED: Imported; Vendor: Vishay-Dale; rn: Rfbb; Manufacturer_Part_Number: CRCW04023K16FKED; Manufacturer_Name: Vishay-Dale; RefDes: RefDes; TYPE: TYPE
R18 = CRCW040210K0FKED: Imported; Vendor: Vishay-Dale; rn: Ruvb; Manufacturer_Part_Number: CRCW040210K0FKED; Manufacturer_Name: Vishay-Dale; RefDes: RefDes; TYPE: TYPE
R19 = CRCW040286K6FKED: Imported; Vendor: Vishay-Dale; rn: Rslope; Manufacturer_Part_Number: CRCW040286K6FKED; Manufacturer_Name: Vishay-Dale; RefDes: RefDes; TYPE: TYPE
R20 = CRCW040219K6FKED: Imported; Vendor: Vishay-Dale; rn: Rt; Manufacturer_Part_Number: CRCW040219K6FKED; Manufacturer_Name: Vishay-Dale; RefDes: RefDes; TYPE: TYPE
U5 = LM5122MH/NOPB: Imported; Vendor: Texas Instruments; Value: Value; Manufacturer_Part_Number: LM5122MH/NOPB; Manufacturer_Name: Texas Instruments; RefDes: RefDes; TYPE: TYPE

## Sheet Power5V.SchDoc
size 312 x 144 mm; SheetNumber: 1; SheetTotal: 1
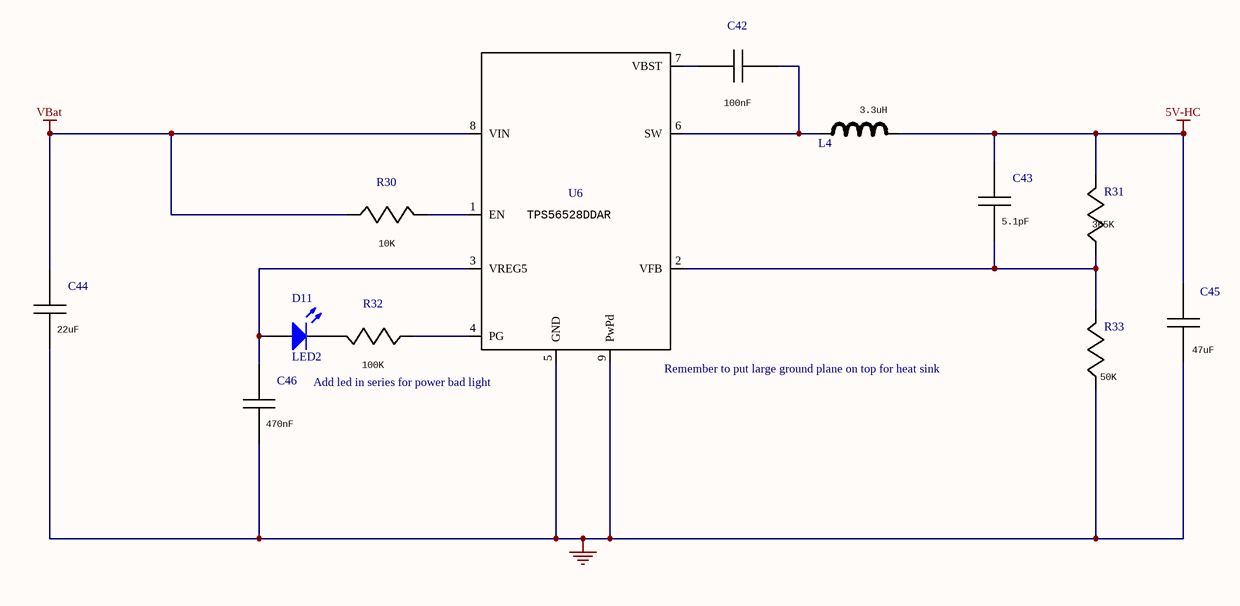
[diagram p4: Power5V.SchDoc]

### Parts
C42  value 100nF  [1608]  (hidden comment: C1005X5R1A104K)
C43  value 5.1pF  [1608]  (hidden comment: GRM1555C1E5R1CA0)
C44  value 22uF  [1210]  (hidden comment: GRM32ER61E226KE1)
C45  value 47uF  [1210]  (hidden comment: C3216X6S1A476M)
C46  value 470nF  [1608]  (hidden comment: GRM155R61A474KE1)
D11  LED2  [1608[0603]]
L4  value 3.3uH  [IHLP-3232DZ]  (hidden comment: IHLP3232DZER3R3M)
R30  value 10K  [1608]  (hidden comment: CRCW040210K0FKED)
R31  value 365K  [1608]  (hidden comment: CRCW0402365KFKED)
R32  value 100K  [1608]  (hidden comment: CRCW0402100KFKED)
R33  value 50K  [1608]  (hidden comment: CRCW040249K9FKED)
U6  TPS56528DDAR  [R-PDSO-G8]

### Nets
5V-HC: C43.1 C45.1 L4.2 R31.1
GND: C44.2 C45.2 C46.2 R33.2 U6.5(GND) U6.9(PwPd)
VBat: C44.1 R30.2 U6.8(VIN)
NetC42_1: C42.1 U6.7(VBST)
NetC42_2: C42.2 L4.1 U6.6(SW)
NetC43_2: C43.2 R31.2 R33.1 U6.2(VFB)
NetC46_1: C46.1 D11.1(A) U6.3(VREG5)
NetD11_2: D11.2(K) R32.1
NetR30_1: R30.1 U6.1(EN)
NetR32_2: R32.2 U6.4(PG)

### Notes on the sheet
- Add led in series for power bad light
- (near U6) Remember to put large ground plane on top for heat sink

### Library data of the parts
C42 = C1005X5R1A104K: Imported; Vendor: TDK; rn: Cbst; Manufacturer_Part_Number: C1005X5R1A104K; Manufacturer_Name: TDK; RefDes: RefDes; TYPE: TYPE
C43 = GRM1555C1E5R1CA0: Imported; Manufacturer_Part_Number: GRM1555C1E5R1CA01D; Vendor: MuRata; rn: Cff; Manufacturer_Name: MuRata; RefDes: RefDes; TYPE: TYPE
C44 = GRM32ER61E226KE1: Imported; Manufacturer_Part_Number: GRM32ER61E226KE15L; Vendor: MuRata; rn: Cin; Manufacturer_Name: MuRata; RefDes: RefDes; TYPE: TYPE
C45 = C3216X6S1A476M: Imported; Vendor: TDK; rn: Cout; Manufacturer_Part_Number: C3216X6S1A476M; Manufacturer_Name: TDK; RefDes: RefDes; TYPE: TYPE
C46 = GRM155R61A474KE1: Imported; Manufacturer_Part_Number: GRM155R61A474KE15D; Vendor: MuRata; rn: Creg; Manufacturer_Name: MuRata; RefDes: RefDes; TYPE: TYPE
D11 = LED2: as D2 on sheet Control; Published: 8-Jun-2000; LatestRevisionDate: 17-Jul-2002; LatestRevisionNote: Re-released for DXP Platform.; PackageVersion: Feb-2002; PackageReference: 3.2X1.6X1.1; Publisher: Altium Limited; PackageDescription: SM LED; 2 Flat Leads
L4 = IHLP3232DZER3R3M: Imported; Manufacturer_Part_Number: IHLP3232DZER3R3M01; Manufacturer: Vishay; Vendor: Vishay-Dale; PACKAGE_DESIGNATOR: IHLP-3232DZ; Manufacturer_Name: Vishay-Dale; RefDes: RefDes; TYPE: TYPE
R30 = CRCW040210K0FKED: Imported; Vendor: Vishay-Dale; rn: Ren; Manufacturer_Part_Number: CRCW040210K0FKED; Manufacturer_Name: Vishay-Dale; RefDes: RefDes; TYPE: TYPE
R31 = CRCW0402365KFKED: Imported; Vendor: Vishay-Dale; rn: Rfbt; Manufacturer_Part_Number: CRCW0402365KFKED; Manufacturer_Name: Vishay-Dale; RefDes: RefDes; TYPE: TYPE
R32 = CRCW0402100KFKED: Imported; Vendor: Vishay-Dale; rn: Rpgood; Manufacturer_Part_Number: CRCW0402100KFKED; Manufacturer_Name: Vishay-Dale; RefDes: RefDes; TYPE: TYPE
R33 = CRCW040249K9FKED: Imported; Vendor: Vishay-Dale; rn: Rfbb; Manufacturer_Part_Number: CRCW040249K9FKED; Manufacturer_Name: Vishay-Dale; RefDes: RefDes; TYPE: TYPE
U6 = TPS56528DDAR: Imported; Vendor: Texas Instruments; Value: Value; Manufacturer_Part_Number: TPS56528DDAR; Manufacturer_Name: Texas Instruments; RefDes: RefDes; TYPE: TYPE

## Sheet Power7V4.SchDoc
size 441 x 172 mm; SheetNumber: 1; SheetTotal: 1
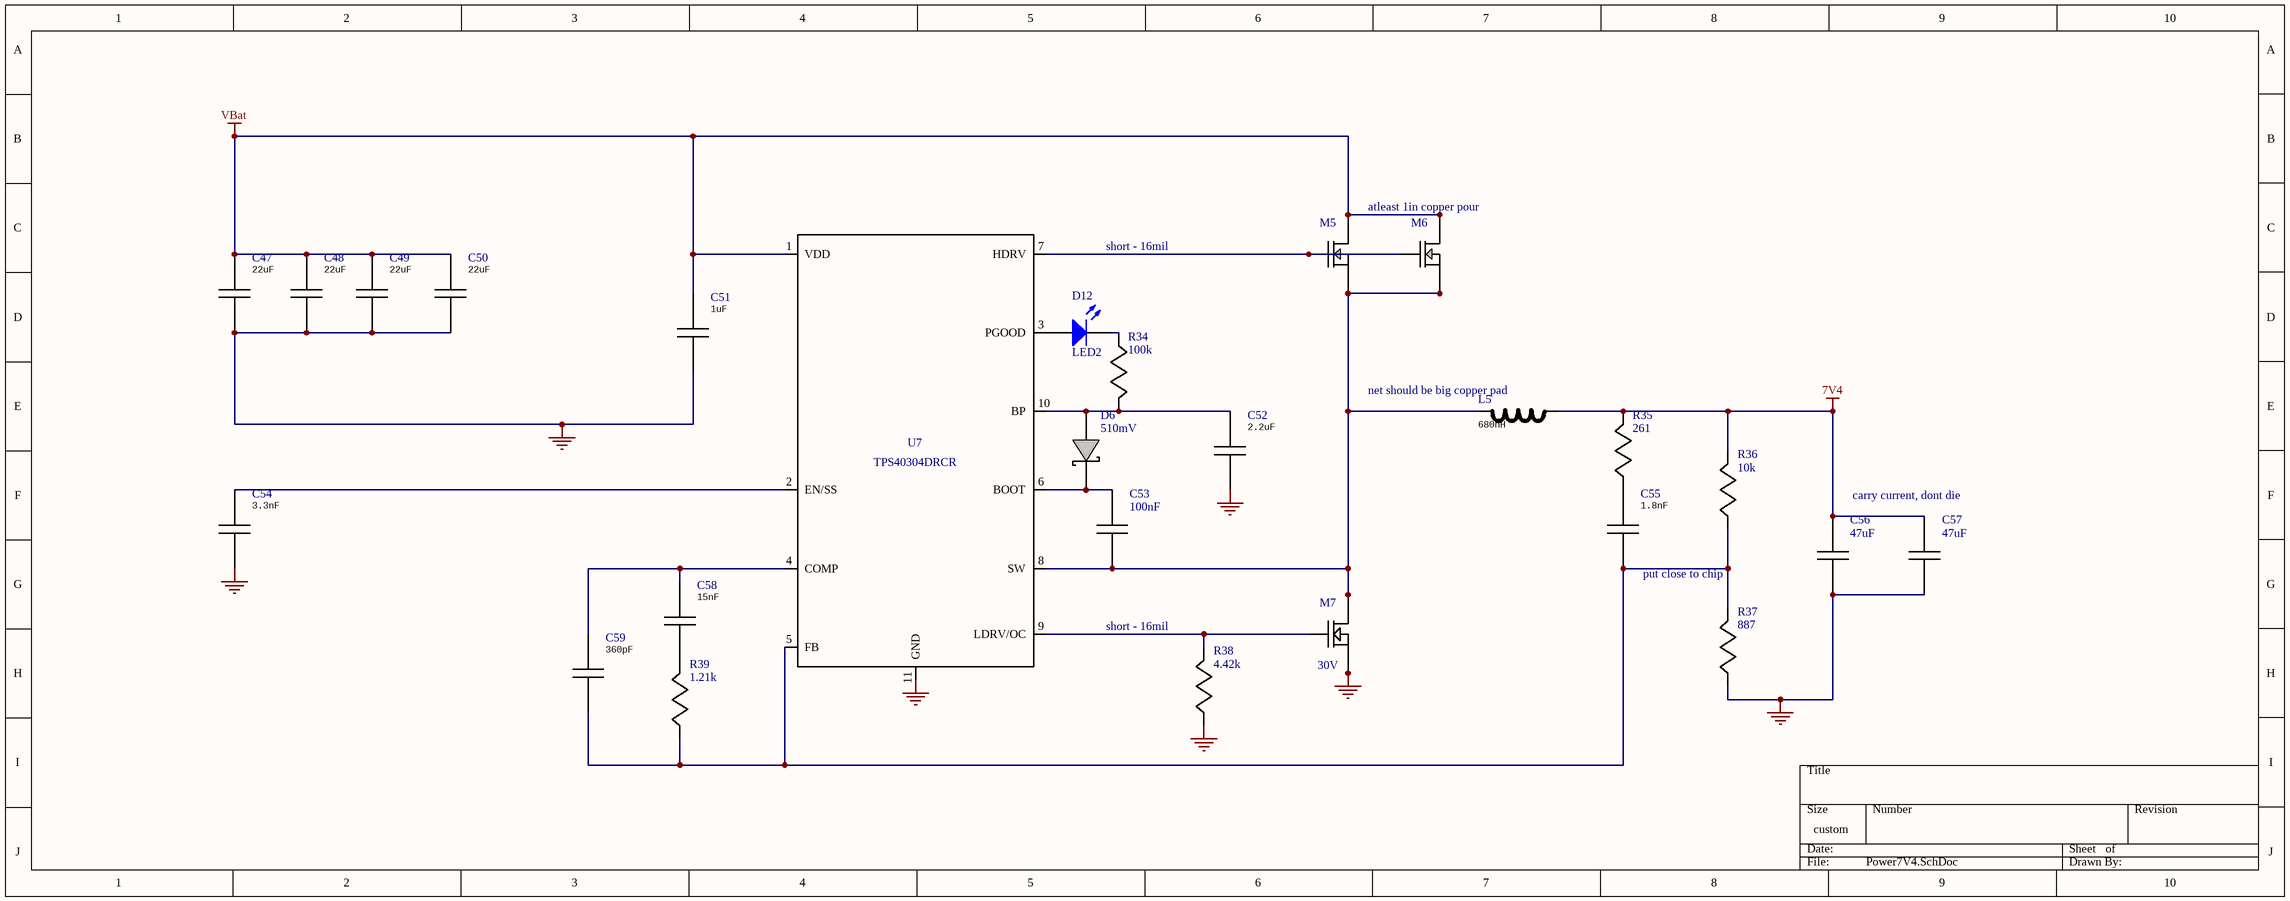
[diagram p5: Power7V4.SchDoc]

### Parts
C47  value 22uF  [1210]  (hidden comment: GRM32ER61E226KE1)
C48  value 22uF  [1210]  (hidden comment: GRM32ER61E226KE1)
C49  value 22uF  [1210]  (hidden comment: GRM32ER61E226KE1)
C50  value 22uF  [1210]  (hidden comment: GRM32ER61E226KE1)
C51  value 1uF  [1608]  (hidden comment: GRM188R61E105KA1)
C52  value 2.2uF  [1608]  (hidden comment: GRM188R61A225KE3)
C53  value 100nF  [1608]  (hidden comment: 08053C104KAT2A)
C54  value 3.3nF  [1608]  (hidden comment: GRM033R71C332KA8)
C55  value 1.8nF  [1608]  (hidden comment: GRM155R71H182KA0)
C56  value 47uF  [1206]  (hidden comment: C3216X6S1A476M)
C57  value 47uF  [1206]  (hidden comment: C3216X6S1A476M)
C58  value 15nF  [1608]  (hidden comment: CC0805KRX7R9BB15)
C59  value 360pF  [1608]  (hidden comment: GRM1555C1H361JA0)
D6  value 510mV  [SOD-123]  (hidden comment: MBR0540T1G)
D12  LED2  [1608[0603]]
L5  value 680nH  [XAL1010]  (hidden comment: XAL1010-681MEB)
M5  CSD16340Q3  [TRANS_NexFET_Q3]  (value not drawn)
M6  CSD16340Q3  [TRANS_NexFET_Q3]  (value not drawn)
M7  value 30V  [PG-TSDSON-8]  (hidden comment: BSZ050N03MS G)
R34  value 100k  [1608]  (hidden comment: CRCW0402100KFKED)
R35  value 261  [1608]  (hidden comment: CRCW0402261RFKED)
R36  value 10k  [1608]  (hidden comment: CRCW040210K0FKED)
R37  value 887  [1608]  (hidden comment: CRCW0402887RFKED)
R38  value 4.42k  [1608]  (hidden comment: CRCW04024K42FKED)
R39  value 1.21k  [1608]  (hidden comment: CRCW04021K21FKED)
U7  TPS40304DRCR  [S-PVSON-N10]

### Nets
7V4: C56.1 C57.1 L5.2 R35.1 R36.1
GND: C47.2 C48.2 C49.2 C50.2 C51.2 C52.2 C54.2 C56.2 C57.2 M7.1(Source) M7.2(Source) M7.3(Source) R37.2 R38.2 U7.11(GND)
VBat: C47.1 C48.1 C49.1 C50.1 C51.1 M5.5(Drain) M5.6(Drain) M5.7(Drain) M5.8(Drain) M5.9(Drain) M6.5(Drain) M6.6(Drain) M6.7(Drain) M6.8(Drain) M6.9(Drain) U7.1(VDD)
NetC52_1: C52.1 D6.2(A) R34.1 U7.10(BP)
NetC53_1: C53.1 D6.1(K) U7.6(BOOT)
NetC53_2: C53.2 L5.1 M5.1(Source) M5.2(Source) M5.3(Source) M6.1(Source) M6.2(Source) M6.3(Source) M7.5(Drain) M7.6(Drain) M7.7(Drain) M7.8(Drain) M7.9(Drain) U7.8(SW)
NetC54_1: C54.1 U7.2(EN/SS)
NetC55_1: C55.1 R35.2
NetC55_2: C55.2 C59.1 R36.2 R37.1 R39.2 U7.5(FB)
NetC58_1: C58.1 R39.1
NetC58_2: C58.2 C59.2 U7.4(COMP)
NetD12_1: D12.1(A) U7.3(PGOOD)
NetD12_2: D12.2(K) R34.2
NetM5_4: M5.4(Gate) M6.4(Gate) U7.7(HDRV)
NetM7_4: M7.4(Gate) R38.1 U7.9(LDRV/OC)

### Notes on the sheet
- short - 16mil
- (near M6) atleast 1in copper pour
- (near L5) net should be big copper pad
- carry current, dont die
- put close to chip
- (near R38) short - 16mil

### Library data of the parts
C47-C50 = GRM32ER61E226KE1: Imported; Manufacturer_Part_Number: GRM32ER61E226KE15L; Vendor: MuRata; Manufacturer_Name: MuRata; RefDes: RefDes; TYPE: TYPE
C51 = GRM188R61E105KA1: Imported; Manufacturer_Part_Number: GRM188R61E105KA12D; Vendor: MuRata; rn: Cvcc; Manufacturer_Name: MuRata; RefDes: RefDes; TYPE: TYPE
C52 = GRM188R61A225KE3: Imported; Manufacturer_Part_Number: GRM188R61A225KE34D; Vendor: MuRata; rn: Cbyp; Manufacturer_Name: MuRata; RefDes: RefDes; TYPE: TYPE
C53 = 08053C104KAT2A: Manufacturer Name: AVX; rn: Cbst; PackageReference: 08053C104KAT2A; Manufacturer Part Number: 08053C104KAT2A
C54 = GRM033R71C332KA8: Imported; Manufacturer_Part_Number: GRM033R71C332KA88D; Vendor: MuRata; rn: Css; Manufacturer_Name: MuRata; RefDes: RefDes; TYPE: TYPE
C55 = GRM155R71H182KA0: Imported; Manufacturer_Part_Number: GRM155R71H182KA01D; Vendor: MuRata; rn: Ccomp3; Manufacturer_Name: MuRata; RefDes: RefDes; TYPE: TYPE
C56 = C3216X6S1A476M: Manufacturer Name: TDK; rn: Cout; PackageReference: C3216X6S1A476M; Manufacturer Part Number: C3216X6S1A476M
C57 = C3216X6S1A476M: Manufacturer Name: TDK; rn: Cout_2; PackageReference: C3216X6S1A476M; Manufacturer Part Number: C3216X6S1A476M
C58 = CC0805KRX7R9BB15: Imported; Manufacturer_Part_Number: CC0805KRX7R9BB153; Vendor: Yageo America; rn: Ccomp; Manufacturer_Name: Yageo America; RefDes: RefDes; TYPE: TYPE
C59 = GRM1555C1H361JA0: Imported; Manufacturer_Part_Number: GRM1555C1H361JA01D; Vendor: MuRata; rn: Ccomp2; Manufacturer_Name: MuRata; RefDes: RefDes; TYPE: TYPE
D6 = MBR0540T1G: Manufacturer Name: ON Semiconductor; rn: Ds; PackageReference: MBR0540T1G; Manufacturer Part Number: MBR0540T1G
D12 = LED2: as D2 on sheet Control; Published: 8-Jun-2000; LatestRevisionDate: 17-Jul-2002; LatestRevisionNote: Re-released for DXP Platform.; PackageVersion: Feb-2002; PackageReference: 3.2X1.6X1.1; Publisher: Altium Limited; PackageDescription: SM LED; 2 Flat Leads
L5 = XAL1010-681MEB: Imported; Manufacturer_Part_Number: XAL1010-451MEB; Vendor: Coilcraft; Manufacturer_Name: Coilcraft; RefDes: RefDes; TYPE: TYPE
M5 M6 = CSD16340Q3: Imported; Vendor: Texas Instruments; Value: Value; Manufacturer_Part_Number: CSD16340Q3; Manufacturer_Name: Texas Instruments; RefDes: RefDes; TYPE: TYPE
M7 = BSZ050N03MS G: Manufacturer Name: Infineon Technologies; PackageReference: BSZ050N03MS G; Manufacturer Part Number: BSZ050N03MS G
R34 = CRCW0402100KFKED: Manufacturer Name: Vishay-Dale; rn: Rpgood; PackageReference: CRCW0402100KFKED; Manufacturer Part Number: CRCW0402100KFKED
R35 = CRCW0402261RFKED: Manufacturer Name: Vishay-Dale; rn: Rcomp2; PackageReference: CRCW0402261RFKED; Manufacturer Part Number: CRCW0402261RFKED
R36 = CRCW040210K0FKED: Manufacturer Name: Vishay-Dale; rn: Rfbt; PackageReference: CRCW040210K0FKED; Manufacturer Part Number: CRCW040210K0FKED
R37 = CRCW0402887RFKED: Manufacturer Name: Vishay-Dale; rn: Rfbb; PackageReference: CRCW0402887RFKED; Manufacturer Part Number: CRCW0402887RFKED
R38 = CRCW04024K42FKED: Manufacturer Name: Vishay-Dale; rn: Rs; PackageReference: CRCW04024K42FKED; Manufacturer Part Number: CRCW04024K42FKED
R39 = CRCW04021K21FKED: Manufacturer Name: Vishay-Dale; rn: Rcomp; PackageReference: CRCW04021K21FKED; Manufacturer Part Number: CRCW04021K21FKED
U7 = TPS40304DRCR: Manufacturer Name: Texas Instruments; Value: UNLISTED; PackageReference: TPS40304DRCR; Manufacturer Part Number: TPS40304DRCR

## Sheet Power.SchDoc
size A4
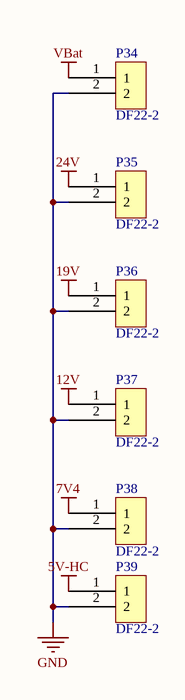
[diagram p6: Power.SchDoc]

### Parts
P34  DF22-2  [DF22-2]
P35  DF22-2  [DF63]
P36  DF22-2  [DF63]
P37  DF22-2  [DF63]
P38  DF22-2  [DF63]
P39  DF22-2  [DF63]

### Nets
5V-HC: P39.1
7V4: P38.1
12V: P37.1
19V: P36.1
24V: P35.1
GND: P34.2 P35.2 P36.2 P37.2 P38.2 P39.2
VBat: P34.1

### Library data of the parts
P34-P39 = DF22-2: CONN HEADER 2POS 7.92MM PCB TIN

## Nets that join several sheets
5V-HC: Control (8 pins), Power5V (C43.1 C45.1 L4.2 R31.1), Power (P39.1)
7V4: Control (6 pins), Power7V4 (5 pins), Power (P38.1)
12V: Power12V (C35.1 D5.3 R21.1), Power (P37.1)
19V: Power19V (9 pins), Power (P36.1)
24V: Power24V (C14.1 C18.1 D1.1 R7.1), Power (P35.1)
GND: Control (65 pins), Power24V (13 pins), Power12V (11 pins), Power19V (20 pins), Power5V (6 pins), Power7V4 (15 pins), Power (6 pins)
VBat: Control (R40.2), Power24V (6 pins), Power12V (C36.1 L3.1 R25.2 U1.1), Power19V (5 pins), Power5V (C44.1 R30.2 U6.8), Power7V4 (16 pins), Power (P34.1)